# Altium schematic sheet PCB_Switch.SchDoc
size Letter
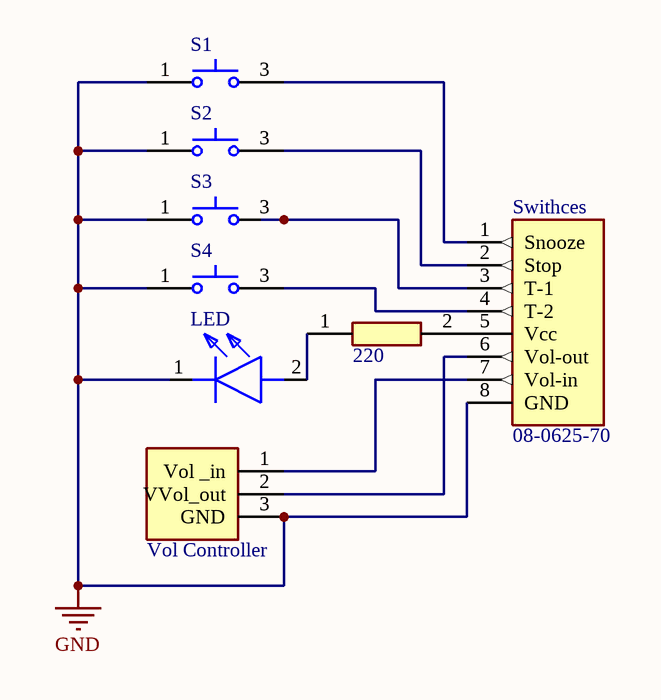
[diagram p0: PCB_Switch.SchDoc]

## Parts
LED  SSL-LX5093TC  [SSL-LX5093SGC/B]  (value not drawn)
R  220  [RESAD2400W59L1000D350]
S1  EP11SD1CBE  [EP11SD1CBE]  (value not drawn)
S2  EP11SD1CBE  [EP11SD1CBE]  (value not drawn)
S3  EP11SD1CBE  [EP11SD1CBE]  (value not drawn)
S4  EP11SD1CBE  [EP11SD1CBE]  (value not drawn)
Swithces  08-0625-70  [HDRV8W51P0X254_1X8_2032X254X816P]
Vol_Controller  14910A0BHSX10502KA  [14910F0GJSX10103KA]  (value not drawn)

## Nets
GND: LED.1(K) S1.1(NO_1) S2.1(NO_1) S3.1(NO_1) S4.1(NO_1) Swithces.8(GND) Vol_Controller.3(GND)
NetLED_2: LED.2(A) R.1
NetR_2: R.2 Swithces.5(Vcc)
NetS1_3: S1.3(NO_2) Swithces.1(Snooze)
NetS2_3: S2.3(NO_2) Swithces.2(Stop)
NetS3_3: S3.3(NO_2) Swithces.3(T-1)
NetS4_3: S4.3(NO_2) Swithces.4(T-2)
NetSwithces_6: Swithces.6(Vol-out) Vol_Controller.2(VVol_out)
NetSwithces_7: Swithces.7(Vol-in) Vol_Controller.1(Vol__in)

## Library data of the parts
LED = SSL-LX5093TC: LED; Manufacturer_Name: Lumex; Datasheet Link: http://www.lumex.com.tw/spec/SSL-LX5093TC.pdf; Manufacturer_Part_Number: SSL-LX5093TC; Mouser Part Number: 696-SSL-LX5093TC; Mouser Price/Stock: https://www.mouser.co.uk/ProductDetail/Lumex/SSL-LX5093TC?qs=94qWIstW55WGdi06hcoEWQ%3D%3D; Arrow Part Number: SSL-LX5093TC; Arrow Price/Stock: https://www.arrow.com/en/products/ssl-lx5093tc/lumex?region=nac
R = 293-220-RC: Resistor; Manufacturer_Name: KOA Speer; Datasheet Link: https://www.mouser.co.uk/datasheet/2/351/xicon_10042017_XC-600035-1-1201685.pdf; Manufacturer_Part_Number: 293-220-RC; Arrow Part Number: 293-220-RC; Arrow Price/Stock: https://www.arrow.com/en/products/293-220-rc/koa-speer-electronics
S1-S4 = EP11SD1CBE: Switch (2-Pin Push); Manufacturer_Name: C & K COMPONENTS; Datasheet Link: https://www.ckswitches.com/media/1408/ep.pdf; Height: 18mm; Manufacturer_Part_Number: EP11SD1CBE; Mouser Part Number: 611-EP11-003; Mouser Price/Stock: https://www.mouser.co.uk/ProductDetail/CK/EP11SD1CBE/?qs=iGs0Ib%2FftARmZmOE2VC3xw%3D%3D; Arrow Part Number: EP11SD1CBE; Arrow Price/Stock: https://www.arrow.com/en/products/ep11sd1cbe/ck?region=nac
Swithces = 08-0625-70: Connector; Manufacturer_Name: ARIES; Datasheet Link: https://www.mouser.in/datasheet/2/35/12036-pin-line-header-1224908.pdf; Height: 8.16mm; Manufacturer_Part_Number: 08-0625-70; Mouser Part Number: 535-08-0625-70; Mouser Price/Stock: https://www.mouser.co.uk/ProductDetail/Aries-Electronics/08-0625-70?qs=BpaRKvA4VqGb7C%252By2JfgtQ%3D%3D
Vol_Controller = 14910A0BHSX10502KA: Variable Resistor; Manufacturer_Name: Vishay; Datasheet Link: https://www.mouser.com/datasheet/2/427/148149-239924.pdf; Manufacturer_Part_Number: 14910A0BHSX10502KA; Mouser Part Number: 594-14910A0BHSP502KA; Mouser Price/Stock: https://www.mouser.co.uk/ProductDetail/Vishay-Spectrol/14910A0BHSX10502KA/?qs=sKxHajcpPaBuEjDBnLxOZg%3D%3D